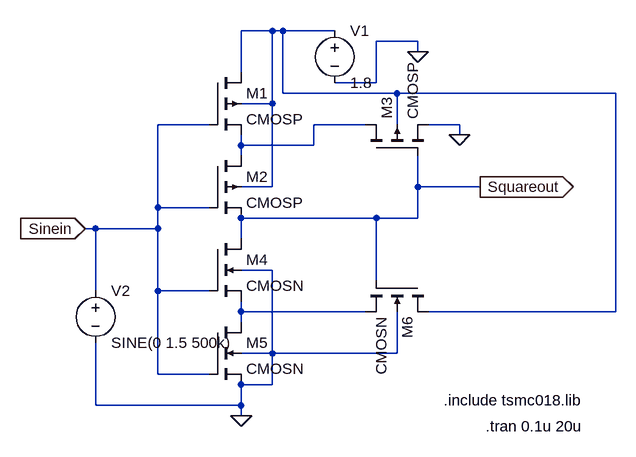
[diagram p0: schematic Schmitt_Trigger_Comparator.asc]
Schmitt_Trigger_Comparator.asc, the LTspice schematic file:
Version 4
SHEET 1 880 680
WIRE 272 -48 224 -48
WIRE 288 -48 272 -48
WIRE 368 -48 288 -48
WIRE 496 -32 432 -32
WIRE 496 -16 496 -32
WIRE 224 16 224 -48
WIRE 432 32 432 -32
WIRE 432 32 368 32
WIRE 288 48 288 -48
WIRE 464 48 288 48
WIRE 800 48 464 48
WIRE 272 64 272 -48
WIRE 272 64 224 64
WIRE 176 96 96 96
WIRE 416 96 336 96
WIRE 464 96 464 48
WIRE 560 96 512 96
WIRE 560 112 560 96
WIRE 224 128 224 112
WIRE 336 128 336 96
WIRE 336 128 224 128
WIRE 224 144 224 128
WIRE 272 192 272 64
WIRE 272 192 224 192
WIRE 496 192 496 144
WIRE 592 192 496 192
WIRE 96 224 96 96
WIRE 176 224 96 224
WIRE 432 240 224 240
WIRE 496 240 496 192
WIRE 496 240 432 240
WIRE 0 256 -16 256
WIRE 96 256 96 224
WIRE 96 256 0 256
WIRE 224 272 224 240
WIRE 272 320 224 320
WIRE 432 336 432 240
WIRE 0 352 0 256
WIRE 96 352 96 256
WIRE 176 352 96 352
WIRE 224 384 224 368
WIRE 416 384 224 384
WIRE 800 384 800 48
WIRE 800 384 512 384
WIRE 224 400 224 384
WIRE 272 448 272 320
WIRE 272 448 224 448
WIRE 464 448 464 384
WIRE 464 448 272 448
WIRE 96 480 96 352
WIRE 176 480 96 480
WIRE 272 496 272 448
WIRE 272 496 224 496
WIRE 0 528 0 432
WIRE 224 528 224 496
WIRE 224 528 0 528
WIRE 224 544 224 528
FLAG 592 192 Squareout
IOPIN 592 192 Out
FLAG -16 256 Sinein
IOPIN -16 256 In
FLAG 224 544 0
FLAG 496 -16 0
FLAG 560 112 0
SYMBOL cmosp 176 16 R0
SYMATTR InstName M1
SYMBOL cmosp 176 144 R0
SYMATTR InstName M2
SYMBOL cmosp 416 144 R270
SYMATTR InstName M3
SYMBOL cmosn 176 272 R0
SYMATTR InstName M4
SYMBOL cmosn 176 400 R0
SYMATTR InstName M5
SYMBOL cmosn 512 336 R90
SYMATTR InstName M6
SYMBOL voltage 368 -64 R0
WINDOW 123 0 0 Left 0
WINDOW 39 0 0 Left 0
SYMATTR InstName V1
SYMATTR Value 1.8
SYMBOL voltage 0 336 R0
WINDOW 123 0 0 Left 0
WINDOW 39 0 0 Left 0
SYMATTR InstName V2
SYMATTR Value SINE(0 1.5 500k)
TEXT 536 520 Left 2 !.include tsmc018.lib
TEXT 600 560 Left 2 !.tran 0.1u 20u

The netlist it stands for:
* Schmitt_Trigger_Comparator.asc
M1 N001 Sinein N002 N001 CMOSP
M2 N002 Sinein Squareout N001 CMOSP
M3 N002 Squareout 0 N001 CMOSP
M4 Squareout Sinein N003 0 CMOSN
M5 N003 Sinein 0 0 CMOSN
M6 N001 Squareout N003 0 CMOSN
V1 N001 0 1.8
V2 Sinein 0 SINE(0 1.5 500k)
.model NMOS NMOS
.model PMOS PMOS
.lib standard.mos
.include tsmc018.lib
.tran 0.1u 20u
.backanno
.end